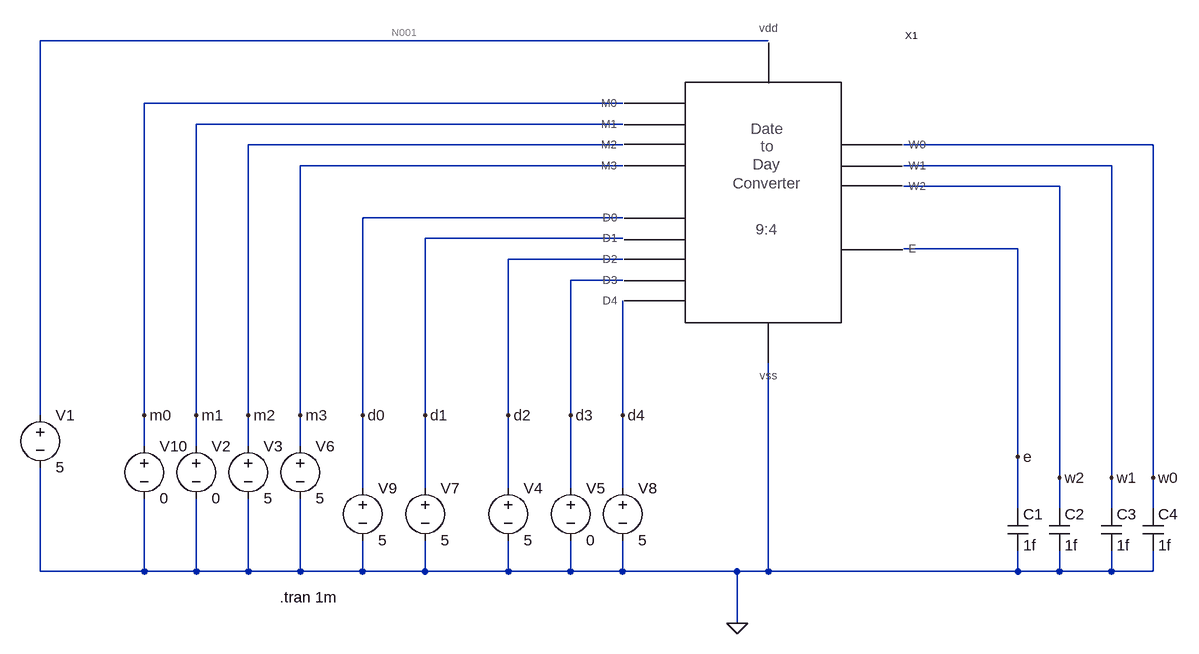
[diagram p0: schematic testbench-Date_to_Day_Converter.asc]
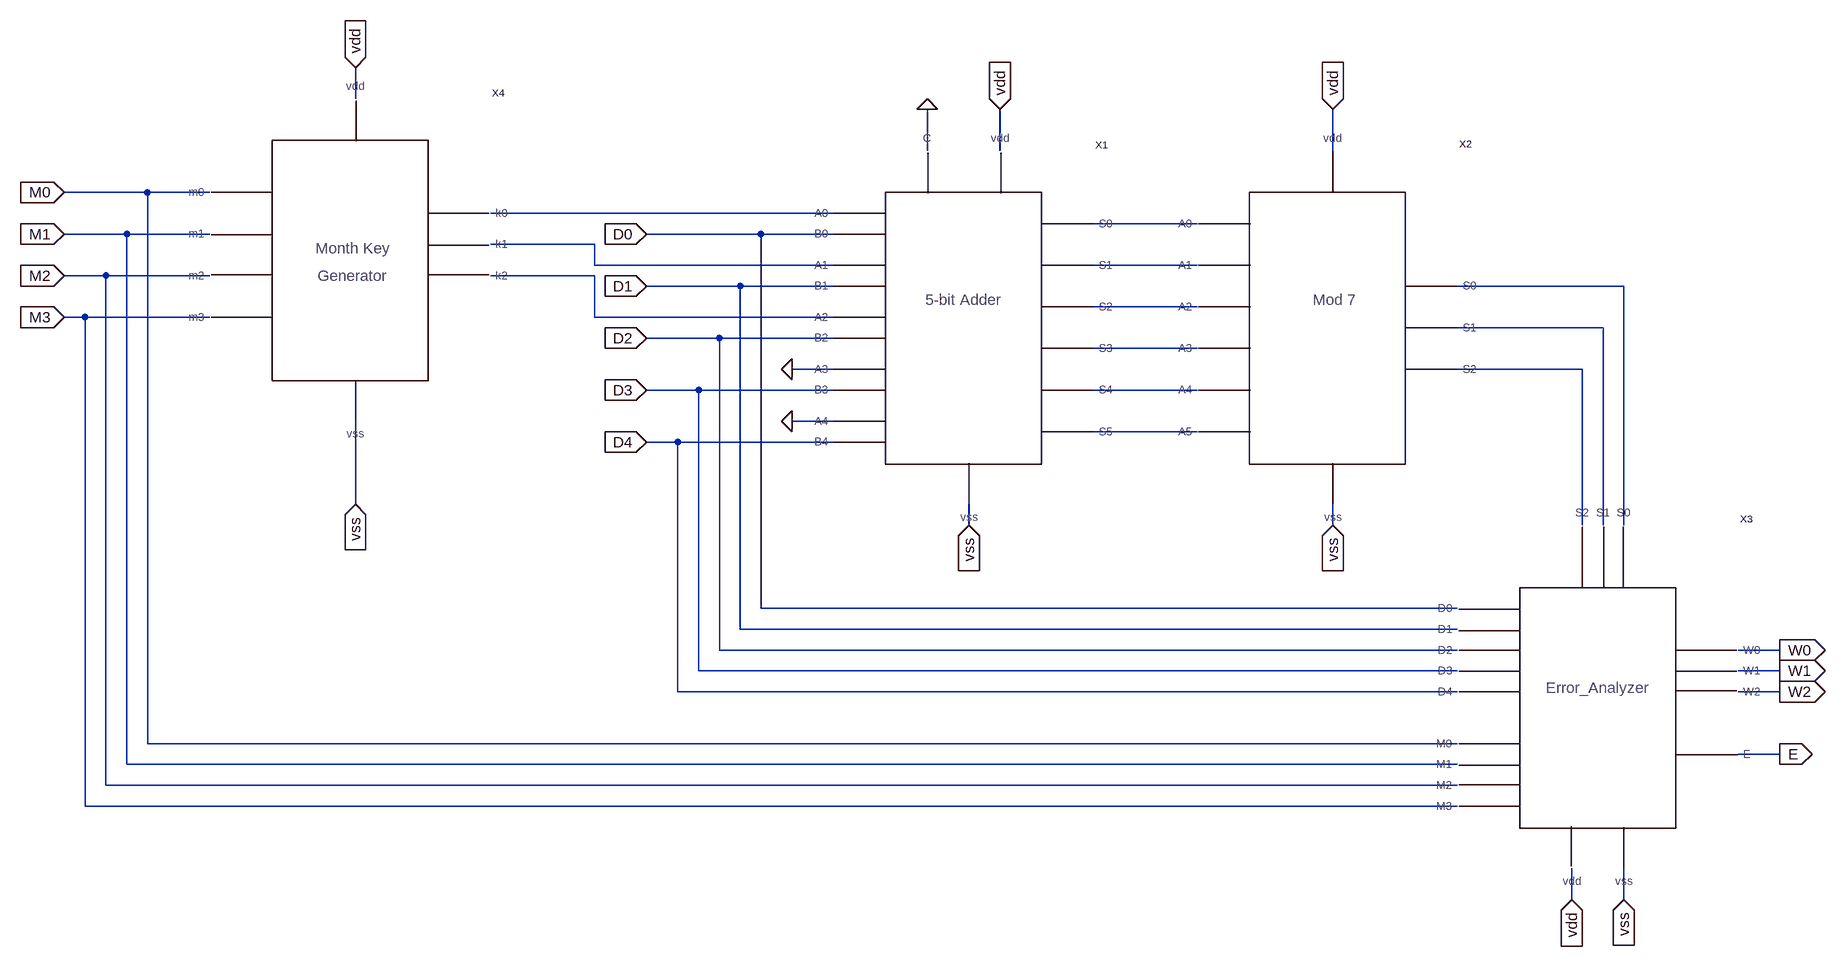
[diagram p1: sub-circuit date_converter.asc]
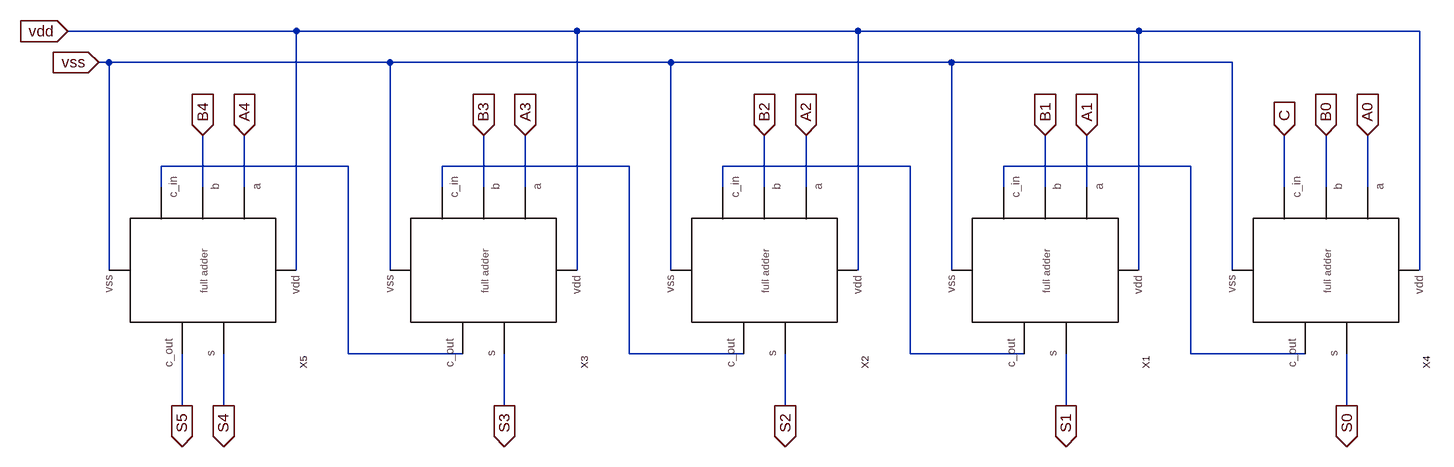
[diagram p2: sub-circuit five_bit_adder.asc]
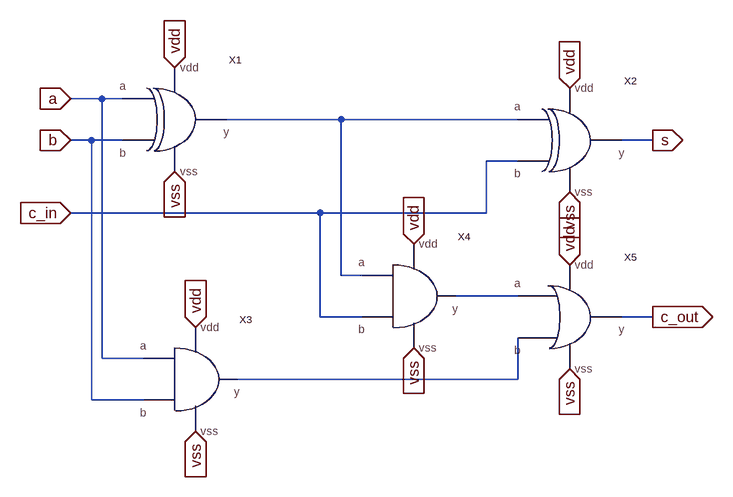
[diagram p3: sub-circuit full_adder.asc]
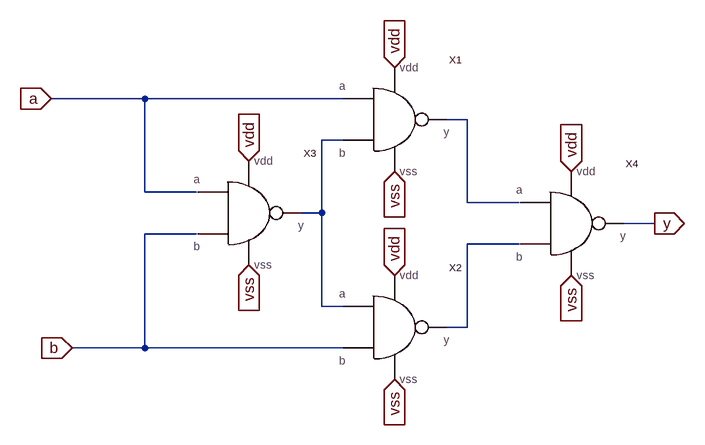
[diagram p4: sub-circuit xor.asc]
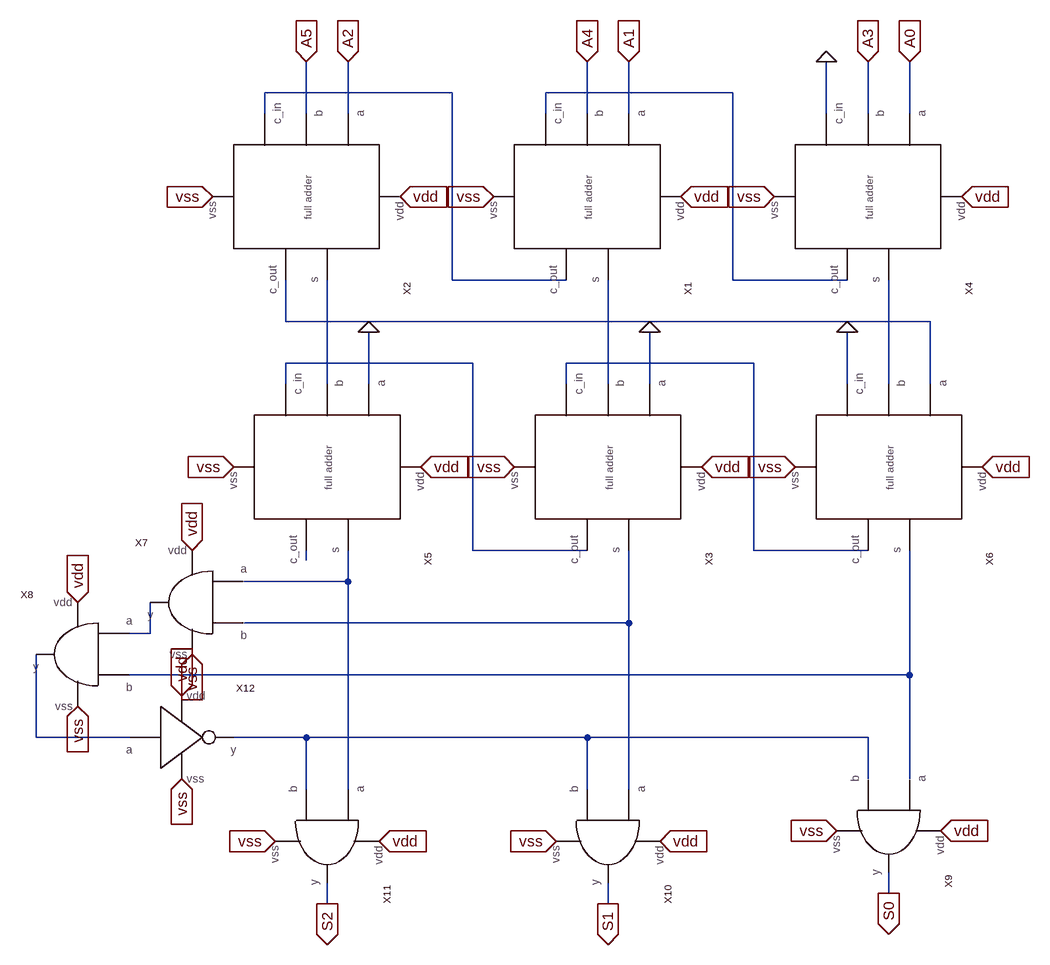
[diagram p5: sub-circuit mod_seven.asc]
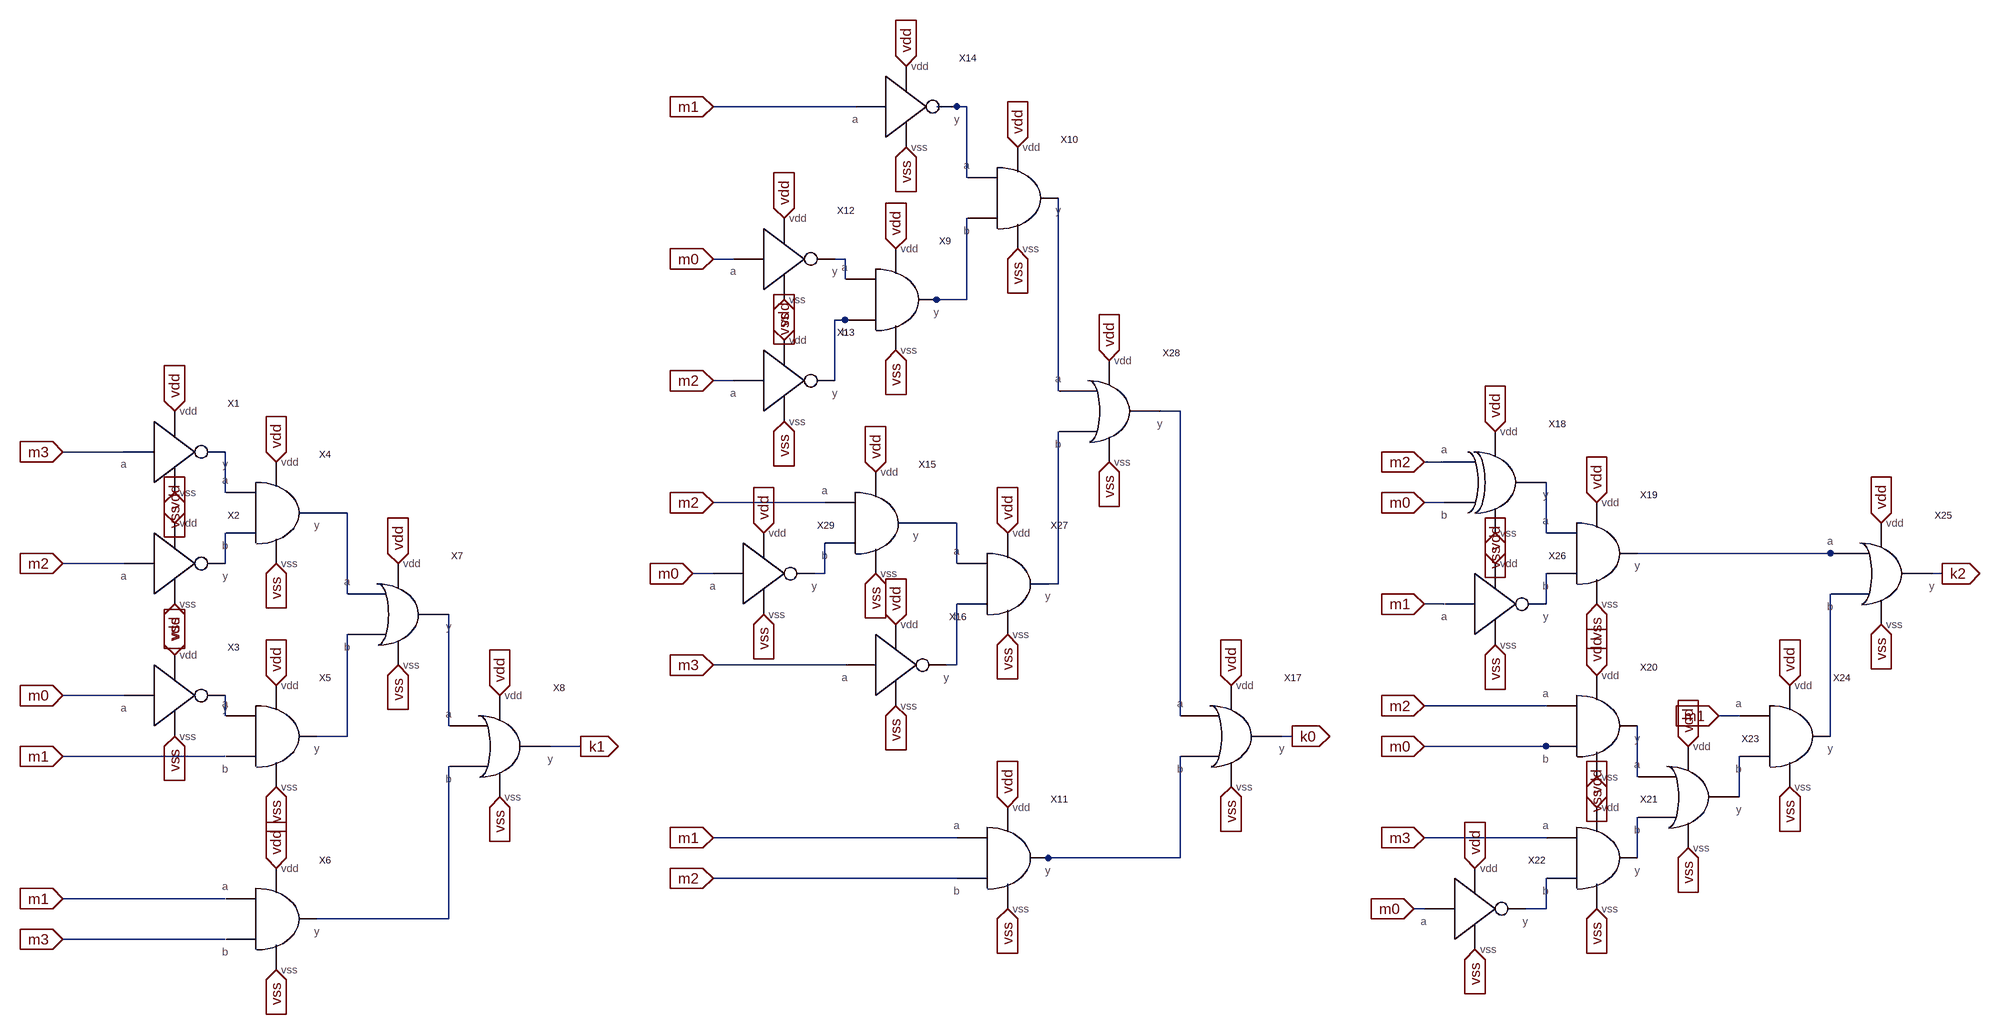
[diagram p6: sub-circuit month_key.asc]
testbench-Date_to_Day_Converter.asc, the LTspice schematic file:
Version 4
SHEET 1 968 680
WIRE 208 -640 -912 -640
WIRE -16 -544 -752 -544
WIRE -16 -512 -672 -512
WIRE -16 -480 -592 -480
WIRE 800 -480 416 -480
WIRE -16 -448 -512 -448
WIRE 736 -448 416 -448
WIRE 656 -416 416 -416
WIRE -16 -368 -416 -368
WIRE -16 -336 -320 -336
WIRE 592 -320 416 -320
WIRE -16 -304 -192 -304
WIRE -16 -272 -96 -272
WIRE -912 -64 -912 -640
WIRE -752 -64 -752 -544
WIRE -672 -64 -672 -512
WIRE -592 -64 -592 -480
WIRE -512 -64 -512 -448
WIRE -416 -64 -416 -368
WIRE -320 -64 -320 -336
WIRE -192 -64 -192 -304
WIRE -96 -64 -96 -272
WIRE -16 -64 -16 -240
WIRE -752 -16 -752 -64
WIRE -672 -16 -672 -64
WIRE -592 -16 -592 -64
WIRE -512 -16 -512 -64
WIRE 592 0 592 -320
WIRE 656 32 656 -416
WIRE 736 32 736 -448
WIRE 800 32 800 -480
WIRE -416 48 -416 -64
WIRE -320 48 -320 -64
WIRE -192 48 -192 -64
WIRE -96 48 -96 -64
WIRE -16 48 -16 -64
WIRE 592 80 592 0
WIRE 656 80 656 32
WIRE 736 80 736 32
WIRE 800 80 800 32
WIRE -912 176 -912 16
WIRE -752 176 -752 64
WIRE -752 176 -912 176
WIRE -672 176 -672 64
WIRE -672 176 -752 176
WIRE -592 176 -592 64
WIRE -592 176 -672 176
WIRE -512 176 -512 64
WIRE -512 176 -592 176
WIRE -416 176 -416 128
WIRE -416 176 -512 176
WIRE -320 176 -320 128
WIRE -320 176 -416 176
WIRE -192 176 -192 128
WIRE -192 176 -320 176
WIRE -96 176 -96 128
WIRE -96 176 -192 176
WIRE -16 176 -16 128
WIRE -16 176 -96 176
WIRE 160 176 -16 176
WIRE 208 176 208 -144
WIRE 208 176 160 176
WIRE 592 176 592 144
WIRE 592 176 208 176
WIRE 656 176 656 144
WIRE 656 176 592 176
WIRE 736 176 736 144
WIRE 736 176 656 176
WIRE 800 176 800 144
WIRE 800 176 736 176
WIRE 160 256 160 176
FLAG 160 256 0
FLAG -752 -64 m0
FLAG -672 -64 m1
FLAG -592 -64 m2
FLAG -512 -64 m3
FLAG -416 -64 d0
FLAG -320 -64 d1
FLAG -192 -64 d2
FLAG -96 -64 d3
FLAG -16 -64 d4
FLAG 592 0 e
FLAG 656 32 w2
FLAG 736 32 w1
FLAG 800 32 w0
SYMBOL voltage -912 -80 R0
WINDOW 123 0 0 Left 0
WINDOW 39 0 0 Left 0
SYMATTR InstName V1
SYMATTR Value 5
SYMBOL cap 576 80 R0
SYMATTR InstName C1
SYMATTR Value 1f
SYMBOL cap 640 80 R0
SYMATTR InstName C2
SYMATTR Value 1f
SYMBOL cap 720 80 R0
SYMATTR InstName C3
SYMATTR Value 1f
SYMBOL cap 784 80 R0
SYMATTR InstName C4
SYMATTR Value 1f
SYMBOL Date_Converter 208 -384 R0
SYMATTR InstName X1
SYMBOL voltage -752 -32 R0
WINDOW 123 0 0 Left 0
WINDOW 39 0 0 Left 0
SYMATTR InstName V10
SYMATTR Value 0
SYMBOL voltage -672 -32 R0
WINDOW 123 0 0 Left 0
WINDOW 39 0 0 Left 0
SYMATTR InstName V2
SYMATTR Value 0
SYMBOL voltage -592 -32 R0
WINDOW 123 0 0 Left 0
WINDOW 39 0 0 Left 0
SYMATTR InstName V3
SYMATTR Value 5
SYMBOL voltage -512 -32 R0
WINDOW 123 0 0 Left 0
WINDOW 39 0 0 Left 0
SYMATTR InstName V6
SYMATTR Value 5
SYMBOL voltage -96 32 R0
WINDOW 123 0 0 Left 0
WINDOW 39 0 0 Left 0
SYMATTR InstName V5
SYMATTR Value 0
SYMBOL voltage -16 32 R0
WINDOW 123 0 0 Left 0
WINDOW 39 0 0 Left 0
SYMATTR InstName V8
SYMATTR Value 5
SYMBOL voltage -192 32 R0
WINDOW 123 0 0 Left 0
WINDOW 39 0 0 Left 0
SYMATTR InstName V4
SYMATTR Value 5
SYMBOL voltage -320 32 R0
WINDOW 123 0 0 Left 0
WINDOW 39 0 0 Left 0
SYMATTR InstName V7
SYMATTR Value 5
SYMBOL voltage -416 32 R0
WINDOW 123 0 0 Left 0
WINDOW 39 0 0 Left 0
SYMATTR InstName V9
SYMATTR Value 5
TEXT -544 216 Left 2 !.tran 1m

date_converter.asc, the sub-circuit schematic file:
Version 4
SHEET 1 1208 736
WIRE -1344 -992 -1344 -1040
WIRE -464 -912 -464 -976
WIRE -352 -912 -352 -976
WIRE 160 -912 160 -976
WIRE -1664 -848 -1792 -848
WIRE -1568 -848 -1664 -848
WIRE -608 -816 -1136 -816
WIRE -48 -800 -208 -800
WIRE -1696 -784 -1792 -784
WIRE -1568 -784 -1696 -784
WIRE -720 -784 -896 -784
WIRE -608 -784 -720 -784
WIRE -976 -768 -1136 -768
WIRE -976 -736 -976 -768
WIRE -608 -736 -976 -736
WIRE -48 -736 -208 -736
WIRE -1728 -720 -1792 -720
WIRE -1568 -720 -1728 -720
WIRE -976 -720 -1136 -720
WIRE -752 -704 -896 -704
WIRE -608 -704 -752 -704
WIRE 608 -704 352 -704
WIRE -48 -672 -208 -672
WIRE -1760 -656 -1792 -656
WIRE -1568 -656 -1760 -656
WIRE -976 -656 -976 -720
WIRE -608 -656 -976 -656
WIRE 576 -640 352 -640
WIRE -784 -624 -896 -624
WIRE -608 -624 -784 -624
WIRE -48 -608 -208 -608
WIRE -608 -576 -672 -576
WIRE 544 -576 352 -576
WIRE -816 -544 -896 -544
WIRE -608 -544 -816 -544
WIRE -48 -544 -208 -544
WIRE -608 -496 -672 -496
WIRE -48 -480 -208 -480
WIRE -848 -464 -896 -464
WIRE -608 -464 -848 -464
WIRE -1344 -368 -1344 -496
WIRE -400 -336 -400 -368
WIRE 160 -336 160 -368
WIRE 544 -336 544 -576
WIRE 576 -336 576 -640
WIRE 608 -336 608 -704
WIRE -720 -208 -720 -784
WIRE 352 -208 -720 -208
WIRE -752 -176 -752 -704
WIRE 352 -176 -752 -176
WIRE -784 -144 -784 -624
WIRE 352 -144 -784 -144
WIRE 848 -144 784 -144
WIRE -816 -112 -816 -544
WIRE 352 -112 -816 -112
WIRE 848 -112 784 -112
WIRE -848 -80 -848 -464
WIRE 352 -80 -848 -80
WIRE 848 -80 784 -80
WIRE -1664 0 -1664 -848
WIRE 352 0 -1664 0
WIRE 848 16 784 16
WIRE -1696 32 -1696 -784
WIRE 352 32 -1696 32
WIRE -1728 64 -1728 -720
WIRE 352 64 -1728 64
WIRE -1760 96 -1760 -656
WIRE 352 96 -1760 96
WIRE 528 240 528 192
WIRE 608 240 608 192
FLAG -896 -784 D0
IOPIN -896 -784 In
FLAG -896 -704 D1
IOPIN -896 -704 In
FLAG -896 -624 D2
IOPIN -896 -624 In
FLAG -896 -544 D3
IOPIN -896 -544 In
FLAG -896 -464 D4
IOPIN -896 -464 In
FLAG -352 -976 vdd
IOPIN -352 -976 In
FLAG -400 -336 vss
IOPIN -400 -336 In
FLAG -464 -976 0
FLAG 160 -976 vdd
IOPIN 160 -976 In
FLAG 160 -336 vss
IOPIN 160 -336 In
FLAG -672 -496 0
FLAG -1344 -1040 vdd
IOPIN -1344 -1040 In
FLAG 528 240 vdd
IOPIN 528 240 In
FLAG -1344 -368 vss
IOPIN -1344 -368 In
FLAG 608 240 vss
IOPIN 608 240 In
FLAG 848 -144 W0
IOPIN 848 -144 Out
FLAG 848 -112 W1
IOPIN 848 -112 Out
FLAG 848 -80 W2
IOPIN 848 -80 Out
FLAG 848 16 E
IOPIN 848 16 Out
FLAG -1792 -848 M0
IOPIN -1792 -848 In
FLAG -1792 -784 M1
IOPIN -1792 -784 In
FLAG -1792 -720 M2
IOPIN -1792 -720 In
FLAG -1792 -656 M3
IOPIN -1792 -656 In
FLAG -672 -576 0
SYMBOL five_bit_adder -400 -656 R0
SYMATTR InstName X1
SYMBOL mod_seven 160 -656 R0
SYMATTR InstName X2
SYMBOL Error_Analyzer 576 -48 R0
SYMATTR InstName X3
SYMBOL month_key -1344 -736 R0
SYMATTR InstName X4

five_bit_adder.asc, the sub-circuit schematic file:
Version 4
SHEET 1 1208 736
WIRE -928 -1152 -1280 -1152
WIRE -496 -1152 -928 -1152
WIRE -64 -1152 -496 -1152
WIRE 368 -1152 -64 -1152
WIRE 800 -1152 368 -1152
WIRE -1216 -1104 -1232 -1104
WIRE -784 -1104 -1216 -1104
WIRE -352 -1104 -784 -1104
WIRE 80 -1104 -352 -1104
WIRE 512 -1104 80 -1104
WIRE -848 -944 -1136 -944
WIRE -416 -944 -704 -944
WIRE 16 -944 -272 -944
WIRE 448 -944 160 -944
WIRE -1136 -912 -1136 -944
WIRE -1072 -912 -1072 -992
WIRE -1008 -912 -1008 -992
WIRE -704 -912 -704 -944
WIRE -640 -912 -640 -992
WIRE -576 -912 -576 -992
WIRE -272 -912 -272 -944
WIRE -208 -912 -208 -992
WIRE -144 -912 -144 -992
WIRE 160 -912 160 -944
WIRE 224 -912 224 -992
WIRE 288 -912 288 -992
WIRE 592 -912 592 -992
WIRE 656 -912 656 -992
WIRE 720 -912 720 -992
WIRE -1216 -784 -1216 -1104
WIRE -928 -784 -928 -1152
WIRE -784 -784 -784 -1104
WIRE -496 -784 -496 -1152
WIRE -352 -784 -352 -1104
WIRE -64 -784 -64 -1152
WIRE 80 -784 80 -1104
WIRE 368 -784 368 -1152
WIRE 512 -784 512 -1104
WIRE 800 -784 800 -1152
WIRE -848 -656 -848 -944
WIRE -672 -656 -848 -656
WIRE -416 -656 -416 -944
WIRE -240 -656 -416 -656
WIRE 16 -656 16 -944
WIRE 192 -656 16 -656
WIRE 448 -656 448 -944
WIRE 624 -656 448 -656
WIRE -1104 -576 -1104 -656
WIRE -1040 -576 -1040 -656
WIRE -608 -576 -608 -656
WIRE -176 -576 -176 -656
WIRE 256 -576 256 -656
WIRE 688 -576 688 -656
FLAG -1280 -1152 vdd
IOPIN -1280 -1152 In
FLAG -1232 -1104 vss
IOPIN -1232 -1104 In
FLAG 288 -992 A1
IOPIN 288 -992 In
FLAG 224 -992 B1
IOPIN 224 -992 In
FLAG 720 -992 A0
IOPIN 720 -992 In
FLAG 656 -992 B0
IOPIN 656 -992 In
FLAG -144 -992 A2
IOPIN -144 -992 In
FLAG -208 -992 B2
IOPIN -208 -992 In
FLAG -576 -992 A3
IOPIN -576 -992 In
FLAG -640 -992 B3
IOPIN -640 -992 In
FLAG -1008 -992 A4
IOPIN -1008 -992 In
FLAG -1072 -992 B4
IOPIN -1072 -992 In
FLAG 688 -576 S0
IOPIN 688 -576 Out
FLAG 256 -576 S1
IOPIN 256 -576 Out
FLAG -176 -576 S2
IOPIN -176 -576 Out
FLAG -608 -576 S3
IOPIN -608 -576 Out
FLAG -1040 -576 S4
IOPIN -1040 -576 Out
FLAG -1104 -576 S5
IOPIN -1104 -576 Out
FLAG 592 -992 C
IOPIN 592 -992 In
SYMBOL full_adder 128 -784 R90
SYMATTR InstName X1
SYMBOL full_adder -304 -784 R90
SYMATTR InstName X2
SYMBOL full_adder -736 -784 R90
SYMATTR InstName X3
SYMBOL full_adder 560 -784 R90
SYMATTR InstName X4
SYMBOL full_adder -1168 -784 R90
SYMATTR InstName X5

full_adder.asc, the sub-circuit schematic file:
Version 4
SHEET 1 1124 680
WIRE 128 -80 80 -80
WIRE 160 -80 128 -80
WIRE 496 -48 320 -48
WIRE 768 -48 496 -48
WIRE 112 -16 80 -16
WIRE 160 -16 112 -16
WIRE 976 -16 928 -16
WIRE 768 16 720 16
WIRE 464 96 80 96
WIRE 720 96 720 16
WIRE 720 96 464 96
WIRE 496 192 496 -48
WIRE 528 192 496 192
WIRE 768 224 672 224
WIRE 464 256 464 96
WIRE 528 256 464 256
WIRE 976 256 928 256
WIRE 128 320 128 -80
WIRE 192 320 128 320
WIRE 768 352 768 288
WIRE 768 352 336 352
WIRE 112 384 112 -16
WIRE 192 384 112 384
FLAG 80 -80 a
IOPIN 80 -80 In
FLAG 240 -128 vdd
IOPIN 240 -128 In
FLAG 976 -16 s
IOPIN 976 -16 Out
FLAG 240 32 vss
IOPIN 240 32 In
FLAG 80 -16 b
IOPIN 80 -16 In
FLAG 848 -96 vdd
IOPIN 848 -96 In
FLAG 848 64 vss
IOPIN 848 64 In
FLAG 80 96 c_in
IOPIN 80 96 In
FLAG 272 272 vdd
IOPIN 272 272 In
FLAG 272 432 vss
IOPIN 272 432 In
FLAG 608 144 vdd
IOPIN 608 144 In
FLAG 608 304 vss
IOPIN 608 304 In
FLAG 976 256 c_out
IOPIN 976 256 Out
FLAG 848 176 vdd
IOPIN 848 176 In
FLAG 848 336 vss
IOPIN 848 336 In
SYMBOL xor 240 -48 R0
SYMATTR InstName X1
SYMBOL xor 848 -16 R0
SYMATTR InstName X2
SYMBOL and 272 352 R0
SYMATTR InstName X3
SYMBOL and 608 224 R0
SYMATTR InstName X4
SYMBOL or 848 256 R0
SYMATTR InstName X5

xor.asc, the sub-circuit schematic file:
Version 4
SHEET 1 1608 784
WIRE 144 128 0 128
WIRE 448 128 144 128
WIRE 640 160 608 160
WIRE 448 192 416 192
WIRE 144 272 144 128
WIRE 224 272 144 272
WIRE 640 288 640 160
WIRE 720 288 640 288
WIRE 416 304 416 192
WIRE 416 304 384 304
WIRE 928 320 880 320
WIRE 224 336 144 336
WIRE 720 352 640 352
WIRE 416 448 416 304
WIRE 448 448 416 448
WIRE 640 480 640 352
WIRE 640 480 608 480
WIRE 144 512 144 336
WIRE 144 512 32 512
WIRE 448 512 144 512
FLAG 0 128 a
IOPIN 0 128 In
FLAG 928 320 y
IOPIN 928 320 Out
FLAG 32 512 b
IOPIN 32 512 In
FLAG 304 224 vdd
IOPIN 304 224 In
FLAG 304 384 vss
IOPIN 304 384 In
FLAG 528 80 vdd
IOPIN 528 80 In
FLAG 528 240 vss
IOPIN 528 240 In
FLAG 528 400 vdd
IOPIN 528 400 In
FLAG 528 560 vss
IOPIN 528 560 In
FLAG 800 240 vdd
IOPIN 800 240 In
FLAG 800 400 vss
IOPIN 800 400 In
SYMBOL nand 304 304 R0
SYMATTR InstName X3
SYMBOL nand 528 160 R0
SYMATTR InstName X1
SYMBOL nand 528 480 R0
SYMATTR InstName X2
SYMBOL nand 800 320 R0
SYMATTR InstName X4

mod_seven.asc, the sub-circuit schematic file:
Version 4
SHEET 1 1208 736
WIRE 16 -944 -272 -944
WIRE 448 -944 160 -944
WIRE -272 -912 -272 -944
WIRE -208 -912 -208 -992
WIRE -144 -912 -144 -992
WIRE 160 -912 160 -944
WIRE 224 -912 224 -992
WIRE 288 -912 288 -992
WIRE 592 -912 592 -992
WIRE 656 -912 656 -992
WIRE 720 -912 720 -992
WIRE 16 -656 16 -944
WIRE 192 -656 16 -656
WIRE 448 -656 448 -944
WIRE 624 -656 448 -656
WIRE -240 -592 -240 -656
WIRE 752 -592 -240 -592
WIRE 48 -528 -240 -528
WIRE 480 -528 192 -528
WIRE -240 -496 -240 -528
WIRE -176 -496 -176 -656
WIRE -112 -496 -112 -576
WIRE 192 -496 192 -528
WIRE 256 -496 256 -656
WIRE 320 -496 320 -576
WIRE 624 -496 624 -576
WIRE 688 -496 688 -656
WIRE 752 -496 752 -592
WIRE 48 -240 48 -528
WIRE 224 -240 48 -240
WIRE 480 -240 480 -528
WIRE 656 -240 480 -240
WIRE -208 -224 -208 -240
WIRE -144 -192 -144 -240
WIRE -144 -192 -304 -192
WIRE 288 -128 288 -240
WIRE 288 -128 -304 -128
WIRE -448 -112 -448 -160
WIRE -448 -112 -480 -112
WIRE 720 -48 720 -240
WIRE 720 -48 -480 -48
WIRE -624 48 -624 -80
WIRE -480 48 -624 48
WIRE -208 48 -320 48
WIRE 224 48 -208 48
WIRE 656 48 224 48
WIRE 656 112 656 48
WIRE 720 112 720 -48
WIRE -208 128 -208 48
WIRE -144 128 -144 -192
WIRE 224 128 224 48
WIRE 288 128 288 -128
WIRE 688 288 688 256
WIRE -176 304 -176 272
WIRE 256 304 256 272
FLAG 288 -992 A1
IOPIN 288 -992 In
FLAG 224 -992 A4
IOPIN 224 -992 In
FLAG 720 -992 A0
IOPIN 720 -992 In
FLAG 656 -992 A3
IOPIN 656 -992 In
FLAG -208 -992 A5
IOPIN -208 -992 In
FLAG 320 -576 0
FLAG -112 -576 0
FLAG -64 -784 vdd
IOPIN -64 -784 In
FLAG 368 -784 vdd
IOPIN 368 -784 In
FLAG 800 -784 vdd
IOPIN 800 -784 In
FLAG 832 -368 vdd
IOPIN 832 -368 In
FLAG 400 -368 vdd
IOPIN 400 -368 In
FLAG -32 -368 vdd
IOPIN -32 -368 In
FLAG -352 -784 vss
IOPIN -352 -784 In
FLAG 80 -784 vss
IOPIN 80 -784 In
FLAG 512 -784 vss
IOPIN 512 -784 In
FLAG 544 -368 vss
IOPIN 544 -368 In
FLAG 112 -368 vss
IOPIN 112 -368 In
FLAG -320 -368 vss
IOPIN -320 -368 In
FLAG 592 -992 0
FLAG -144 -992 A2
IOPIN -144 -992 In
FLAG 624 -576 0
FLAG -560 0 vss
IOPIN -560 0 In
FLAG -400 112 vss
IOPIN -400 112 In
FLAG -384 -80 vss
IOPIN -384 -80 In
FLAG -256 208 vss
IOPIN -256 208 In
FLAG 176 208 vss
IOPIN 176 208 In
FLAG 608 192 vss
IOPIN 608 192 In
FLAG -560 -160 vdd
IOPIN -560 -160 In
FLAG -384 -240 vdd
IOPIN -384 -240 In
FLAG -96 208 vdd
IOPIN -96 208 In
FLAG 336 208 vdd
IOPIN 336 208 In
FLAG 768 192 vdd
IOPIN 768 192 In
FLAG -176 304 S2
IOPIN -176 304 Out
FLAG 256 304 S1
IOPIN 256 304 Out
FLAG 688 288 S0
IOPIN 688 288 Out
FLAG -400 -16 vdd
IOPIN -400 -16 In
SYMBOL full_adder 128 -784 R90
SYMATTR InstName X1
SYMBOL full_adder -304 -784 R90
SYMATTR InstName X2
SYMBOL full_adder 560 -784 R90
SYMATTR InstName X4
SYMBOL full_adder 160 -368 R90
SYMATTR InstName X3
SYMBOL full_adder -272 -368 R90
SYMATTR InstName X5
SYMBOL full_adder 592 -368 R90
SYMATTR InstName X6
SYMBOL and -384 -160 M0
SYMATTR InstName X7
SYMBOL and -560 -80 M0
SYMATTR InstName X8
SYMBOL and 688 192 R90
SYMATTR InstName X9
SYMBOL and 256 208 R90
SYMATTR InstName X10
SYMBOL and -176 208 R90
SYMATTR InstName X11
SYMBOL not -400 48 R0
SYMATTR InstName X12

month_key.asc, the sub-circuit schematic file:
Version 4
SHEET 1 3144 904
WIRE 1248 -608 1024 -608
WIRE 1408 -608 1376 -608
WIRE 1424 -608 1408 -608
WIRE 1424 -496 1424 -608
WIRE 1056 -368 1024 -368
WIRE 1232 -368 1216 -368
WIRE 1232 -336 1232 -368
WIRE 1376 -304 1360 -304
WIRE 1424 -304 1424 -432
WIRE 1424 -304 1376 -304
WIRE 1232 -272 1216 -272
WIRE 1248 -272 1232 -272
WIRE 1056 -176 1024 -176
WIRE 1216 -176 1216 -272
WIRE 1568 -160 1568 -464
WIRE 1760 -128 1728 -128
WIRE 96 -64 0 -64
WIRE 2176 -48 2144 -48
WIRE 256 0 256 -64
WIRE 1200 16 1024 16
WIRE 2176 16 2144 16
WIRE 448 32 400 32
WIRE 1408 48 1344 48
WIRE 2336 64 2336 -16
WIRE 2784 96 2480 96
WIRE 2816 96 2784 96
WIRE 96 112 0 112
WIRE 256 112 256 64
WIRE 1408 112 1408 48
WIRE 1024 128 992 128
WIRE 1200 128 1200 80
WIRE 1200 128 1184 128
WIRE 2960 128 2944 128
WIRE 1568 144 1568 -96
WIRE 1568 144 1552 144
WIRE 448 160 448 32
WIRE 2176 176 2144 176
WIRE 2336 176 2336 128
WIRE 1232 272 1024 272
WIRE 1408 272 1408 176
WIRE 1408 272 1392 272
WIRE 96 320 0 320
WIRE 2336 336 2144 336
WIRE 256 352 256 320
WIRE 1760 352 1760 -128
WIRE 2640 352 2608 352
WIRE 608 368 608 192
WIRE 448 384 448 224
WIRE 448 384 400 384
WIRE 1936 384 1920 384
WIRE 2784 384 2784 160
WIRE 816 400 768 400
WIRE 2336 400 2144 400
WIRE 2352 400 2336 400
WIRE 256 416 0 416
WIRE 2480 448 2480 368
WIRE 2640 480 2640 416
WIRE 1408 544 1024 544
WIRE 2336 544 2144 544
WIRE 1552 576 1536 576
WIRE 1760 576 1760 416
WIRE 1760 576 1552 576
WIRE 2480 576 2480 512
WIRE 1408 608 1024 608
WIRE 256 640 0 640
WIRE 2144 656 2128 656
WIRE 2336 656 2336 608
WIRE 2336 656 2304 656
WIRE 608 672 608 432
WIRE 608 672 400 672
WIRE 256 704 0 704
FLAG 176 -128 vdd
IOPIN 176 -128 In
FLAG 336 -48 vdd
IOPIN 336 -48 In
FLAG 176 256 vdd
IOPIN 176 256 In
FLAG 336 304 vdd
IOPIN 336 304 In
FLAG 336 592 vdd
IOPIN 336 592 In
FLAG 688 320 vdd
IOPIN 688 320 In
FLAG 176 0 vss
IOPIN 176 0 In
FLAG 176 176 vss
IOPIN 176 176 In
FLAG 336 112 vss
IOPIN 336 112 In
FLAG 336 464 vss
IOPIN 336 464 In
FLAG 336 752 vss
IOPIN 336 752 In
FLAG 688 480 vss
IOPIN 688 480 In
FLAG 0 -64 m3
IOPIN 0 -64 In
FLAG 0 112 m2
IOPIN 0 112 In
FLAG 0 320 m0
IOPIN 0 320 In
FLAG 0 416 m1
IOPIN 0 416 In
FLAG 0 640 m1
IOPIN 0 640 In
FLAG 0 704 m3
IOPIN 0 704 In
FLAG 816 400 k1
IOPIN 816 400 Out
FLAG 176 48 vdd
IOPIN 176 48 In
FLAG 528 272 vss
IOPIN 528 272 In
FLAG 528 112 vdd
IOPIN 528 112 In
FLAG 176 384 vss
IOPIN 176 384 In
FLAG 2144 -48 m2
IOPIN 2144 -48 In
FLAG 2144 16 m0
IOPIN 2144 16 In
FLAG 1024 -368 m0
IOPIN 1024 -368 In
FLAG 1024 -176 m2
IOPIN 1024 -176 In
FLAG 1024 544 m1
IOPIN 1024 544 In
FLAG 1024 608 m2
IOPIN 1024 608 In
FLAG 2144 336 m2
IOPIN 2144 336 In
FLAG 2144 400 m0
IOPIN 2144 400 In
FLAG 2144 544 m3
IOPIN 2144 544 In
FLAG 2128 656 m0
IOPIN 2128 656 In
FLAG 2608 352 m1
IOPIN 2608 352 In
FLAG 1136 -432 vdd
IOPIN 1136 -432 In
FLAG 1312 -384 vdd
IOPIN 1312 -384 In
FLAG 1136 -240 vdd
IOPIN 1136 -240 In
FLAG 1488 496 vdd
IOPIN 1488 496 In
FLAG 1840 304 vdd
IOPIN 1840 304 In
FLAG 2256 -96 vdd
IOPIN 2256 -96 In
FLAG 2416 16 vdd
IOPIN 2416 16 In
FLAG 2864 48 vdd
IOPIN 2864 48 In
FLAG 2720 304 vdd
IOPIN 2720 304 In
FLAG 2416 288 vdd
IOPIN 2416 288 In
FLAG 2560 400 vdd
IOPIN 2560 400 In
FLAG 2416 496 vdd
IOPIN 2416 496 In
FLAG 2224 592 vdd
IOPIN 2224 592 In
FLAG 1312 -224 vss
IOPIN 1312 -224 In
FLAG 1488 656 vss
IOPIN 1488 656 In
FLAG 1840 464 vss
IOPIN 1840 464 In
FLAG 2224 720 vss
IOPIN 2224 720 In
FLAG 2416 656 vss
IOPIN 2416 656 In
FLAG 2560 560 vss
IOPIN 2560 560 In
FLAG 2720 464 vss
IOPIN 2720 464 In
FLAG 2864 208 vss
IOPIN 2864 208 In
FLAG 2416 176 vss
IOPIN 2416 176 In
FLAG 2256 64 vss
IOPIN 2256 64 In
FLAG 1136 -112 vss
IOPIN 1136 -112 In
FLAG 1936 384 k0
IOPIN 1936 384 Out
FLAG 2960 128 k2
IOPIN 2960 128 Out
FLAG 2144 176 m1
IOPIN 2144 176 In
FLAG 2256 112 vdd
IOPIN 2256 112 In
FLAG 2256 240 vss
IOPIN 2256 240 In
FLAG 1024 -608 m1
IOPIN 1024 -608 In
FLAG 1024 16 m2
IOPIN 1024 16 In
FLAG 1024 272 m3
IOPIN 1024 272 In
FLAG 1328 -672 vdd
IOPIN 1328 -672 In
FLAG 1504 -544 vdd
IOPIN 1504 -544 In
FLAG 1648 -208 vdd
IOPIN 1648 -208 In
FLAG 1280 -32 vdd
IOPIN 1280 -32 In
FLAG 1488 64 vdd
IOPIN 1488 64 In
FLAG 1312 208 vdd
IOPIN 1312 208 In
FLAG 1328 -544 vss
IOPIN 1328 -544 In
FLAG 1504 -384 vss
IOPIN 1504 -384 In
FLAG 1136 -304 vss
IOPIN 1136 -304 In
FLAG 1648 -48 vss
IOPIN 1648 -48 In
FLAG 1312 336 vss
IOPIN 1312 336 In
FLAG 1488 224 vss
IOPIN 1488 224 In
FLAG 2416 448 vss
IOPIN 2416 448 In
FLAG 1280 128 vss
IOPIN 1280 128 In
FLAG 992 128 m0
IOPIN 992 128 In
FLAG 1104 64 vdd
IOPIN 1104 64 In
FLAG 1104 192 vss
IOPIN 1104 192 In
SYMBOL not 176 -64 R0
SYMATTR InstName X1
SYMBOL not 176 112 R0
SYMATTR InstName X2
SYMBOL not 176 320 R0
SYMATTR InstName X3
SYMBOL and 336 32 R0
SYMATTR InstName X4
SYMBOL and 336 384 R0
SYMATTR InstName X5
SYMBOL and 336 672 R0
SYMATTR InstName X6
SYMBOL or 528 192 R0
SYMATTR InstName X7
SYMBOL or 688 400 R0
SYMATTR InstName X8
SYMBOL and 1312 -304 R0
SYMATTR InstName X9
SYMBOL and 1488 576 R0
SYMATTR InstName X11
SYMBOL not 1136 -368 R0
SYMATTR InstName X12
SYMBOL not 1136 -176 R0
SYMATTR InstName X13
SYMBOL or 1840 384 R0
SYMATTR InstName X17
SYMBOL xor 2256 -16 R0
SYMATTR InstName X18
SYMBOL and 2416 96 R0
SYMATTR InstName X19
SYMBOL and 2416 368 R0
SYMATTR InstName X20
SYMBOL and 2416 576 R0
SYMATTR InstName X21
SYMBOL not 2224 656 R0
SYMATTR InstName X22
SYMBOL or 2560 480 R0
SYMATTR InstName X23
SYMBOL and 2720 384 R0
SYMATTR InstName X24
SYMBOL or 2864 128 R0
SYMATTR InstName X25
SYMBOL not 2256 176 R0
SYMATTR InstName X26
SYMBOL and 1504 -464 R0
SYMATTR InstName X10
SYMBOL not 1328 -608 R0
SYMATTR InstName X14
SYMBOL and 1280 48 R0
SYMATTR InstName X15
SYMBOL not 1312 272 R0
SYMATTR InstName X16
SYMBOL and 1488 144 R0
SYMATTR InstName X27
SYMBOL or 1648 -128 R0
SYMATTR InstName X28
SYMBOL not 1104 128 R0
SYMATTR InstName X29

The netlist it stands for:
* testbench-Date_to_Day_Converter.asc
V1 N001 0 5
C1 e 0 1f
C2 w2 0 1f
C3 w1 0 1f
C4 w0 0 1f
XX1 m0 m1 m2 m3 d0 d1 d2 d3 d4 w0 w1 w2 e N001 0 date_converter
V10 m0 0 0
V2 m1 0 0
V3 m2 0 5
V6 m3 0 5
V5 d3 0 0
V8 d4 0 5
V4 d2 0 5
V7 d1 0 5
V9 d0 0 5

* block symbol definitions
.subckt date_converter M0 M1 M2 M3 D0 D1 D2 D3 D4 W0 W1 W2 E vdd vss
XX1 N001 D0 N003 D1 N005 D2 0 D3 0 D4 0 vdd vss N002 N004 N007 N009 N011 N012 five_bit_adder
XX2 N002 N004 N007 N009 N011 N012 vdd vss N006 N008 N010 mod_seven
XX3 M0 M1 M2 M3 D0 D1 D2 D3 D4 W0 W1 W2 E vdd vss N010 N008 N006 Error_Analyzer  ; pins M0 M1 M2 M3 D0 D1 D2 D3 D4 W0 W1 W2 E vdd vss S2 S1 S0
XX4 M0 M1 M2 M3 vss vdd N001 N003 N005 month_key
.ends date_converter

.subckt five_bit_adder A0 B0 A1 B1 A2 B2 A3 B3 A4 B4 C vdd vss S0 S1 S2 S3 S4 S5
XX1 vdd vss A1 B1 N004 S1 N003 full_adder
XX2 vdd vss A2 B2 N003 S2 N002 full_adder
XX3 vdd vss A3 B3 N002 S3 N001 full_adder
XX4 vdd vss A0 B0 C S0 N004 full_adder
XX5 vdd vss A4 B4 N001 S4 S5 full_adder
.ends five_bit_adder

.subckt full_adder vdd vss a b c_in s c_out
XX1 a b N001 vdd vss xor
XX2 N001 c_in s vdd vss xor
XX3 a b N003 vdd vss and  ; pins a b y vdd vss
XX4 N001 c_in N002 vdd vss and  ; pins a b y vdd vss
XX5 N002 N003 c_out vdd vss or  ; pins a b y vdd vss
.ends full_adder

.subckt xor a b y vdd vss
XX3 a b N002 vdd vss nand  ; pins a b y vdd vss
XX1 a N002 N001 vdd vss nand  ; pins a b y vdd vss
XX2 N002 b N003 vdd vss nand  ; pins a b y vdd vss
XX4 N001 N003 y vdd vss nand  ; pins a b y vdd vss
.ends xor

.subckt mod_seven A0 A1 A2 A3 A4 A5 vdd vss S0 S1 S2
XX1 vdd vss A1 A4 N002 N007 N001 full_adder
XX2 vdd vss A2 A5 N001 N006 N003 full_adder
XX4 vdd vss A0 A3 0 N008 N002 full_adder
XX3 vdd vss 0 N007 N005 N011 N004 full_adder
XX5 vdd vss 0 N006 N004 N010 N009 full_adder
XX6 vdd vss N003 N008 0 N013 N005 full_adder
XX7 N010 N011 N012 vdd vss and  ; pins a b y vdd vss
XX8 N012 N013 N014 vdd vss and  ; pins a b y vdd vss
XX9 N013 N015 S0 vdd vss and  ; pins a b y vdd vss
XX10 N011 N015 S1 vdd vss and  ; pins a b y vdd vss
XX11 N010 N015 S2 vdd vss and  ; pins a b y vdd vss
XX12 N014 N015 vdd vss not  ; pins a y vdd vss
.ends mod_seven

.subckt month_key m0 m1 m2 m3 vss vdd k0 k1 k2
XX1 m3 N007 vdd vss not  ; pins a y vdd vss
XX2 m2 N012 vdd vss not  ; pins a y vdd vss
XX3 m0 N017 vdd vss not  ; pins a y vdd vss
XX4 N007 N012 N008 vdd vss and  ; pins a b y vdd vss
XX5 N017 m1 N019 vdd vss and  ; pins a b y vdd vss
XX6 m1 m3 N026 vdd vss and  ; pins a b y vdd vss
XX7 N008 N019 N018 vdd vss or  ; pins a b y vdd vss
XX8 N018 N026 k1 vdd vss or  ; pins a b y vdd vss
XX9 N002 N004 N003 vdd vss and  ; pins a b y vdd vss
XX11 m1 m2 N023 vdd vss and  ; pins a b y vdd vss
XX12 m0 N002 vdd vss not  ; pins a y vdd vss
XX13 m2 N004 vdd vss not  ; pins a y vdd vss
XX17 N006 N023 k0 vdd vss or  ; pins a b y vdd vss
XX18 m2 m0 N010 vdd vss xor
XX19 N010 N015 N011 vdd vss and  ; pins a b y vdd vss
XX20 m2 m0 N021 vdd vss and  ; pins a b y vdd vss
XX21 m3 N025 N024 vdd vss and  ; pins a b y vdd vss
XX22 m0 N025 vdd vss not  ; pins a y vdd vss
XX23 N021 N024 N022 vdd vss or  ; pins a b y vdd vss
XX24 m1 N022 N020 vdd vss and  ; pins a b y vdd vss
XX25 N011 N020 k2 vdd vss or  ; pins a b y vdd vss
XX26 m1 N015 vdd vss not  ; pins a y vdd vss
XX10 N001 N003 N005 vdd vss and  ; pins a b y vdd vss
XX14 m1 N001 vdd vss not  ; pins a y vdd vss
XX15 m2 N013 N009 vdd vss and  ; pins a b y vdd vss
XX16 m3 N016 vdd vss not  ; pins a y vdd vss
XX27 N009 N016 N014 vdd vss and  ; pins a b y vdd vss
XX28 N005 N014 N006 vdd vss or  ; pins a b y vdd vss
XX29 m0 N013 vdd vss not  ; pins a y vdd vss
.ends month_key

.tran 1m
.backanno
.end

* Results of the author's LTspice run, read from the files saved beside the schematic
* Operating Point, zero values left out:
*   V(n001) = 5 V
*   V(e) = 24.58 nV
*   V(w2) = 5 V
*   V(w1) = 5 V
*   V(w0) = 24.58 nV
*   V(d1) = 5 V
*   V(d2) = 5 V
*   V(d0) = 5 V
*   V(d4) = 5 V
*   V(m2) = 5 V
*   V(m3) = 5 V
*   I(V1) = -5.731 nA
*   Ix(x1:VDD) = 5.731 nA
*   Ix(x1:VSS) = -3.608 nA